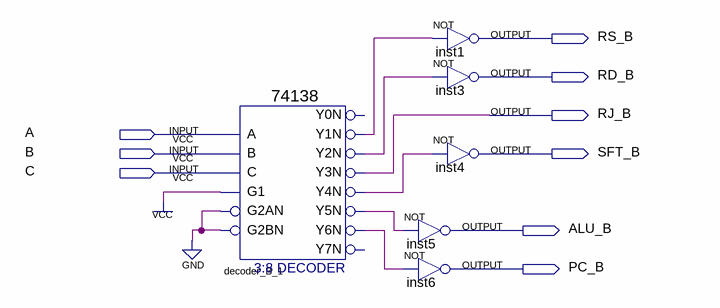
[diagram p0: schematic sheet]
// Quartus schematic decoder_B.bdf as structural Verilog: 6 symbols, 9 pins
module decoder_B (
  input  A,
  input  B,
  input  C,
  output RS_B,
  output RD_B,
  output RJ_B,
  output SFT_B,
  output ALU_B,
  output PC_B
);

  wire decoder_B_1_y1n, decoder_B_1_y2n, decoder_B_1_y4n, decoder_B_1_y5n, decoder_B_1_y6n;

  \74138  decoder_B_1 (
    .A(A), .B(B), .G1(1'b1), .C(C), .G2AN(1'b0), .G2BN(1'b0), .Y1N(decoder_B_1_y1n), .Y2N(decoder_B_1_y2n),
    .Y3N(RJ_B), .Y4N(decoder_B_1_y4n), .Y5N(decoder_B_1_y5n), .Y6N(decoder_B_1_y6n));  // open: Y0N, Y7N
  not inst1 (RS_B, decoder_B_1_y1n);
  not inst3 (RD_B, decoder_B_1_y2n);
  not inst4 (SFT_B, decoder_B_1_y4n);
  not inst5 (ALU_B, decoder_B_1_y5n);
  not inst6 (PC_B, decoder_B_1_y6n);
endmodule
